# Altium schematic sheet Connectors_and_Regs.SchDoc
size A4; SheetNumber: 1; SheetTotal: 5
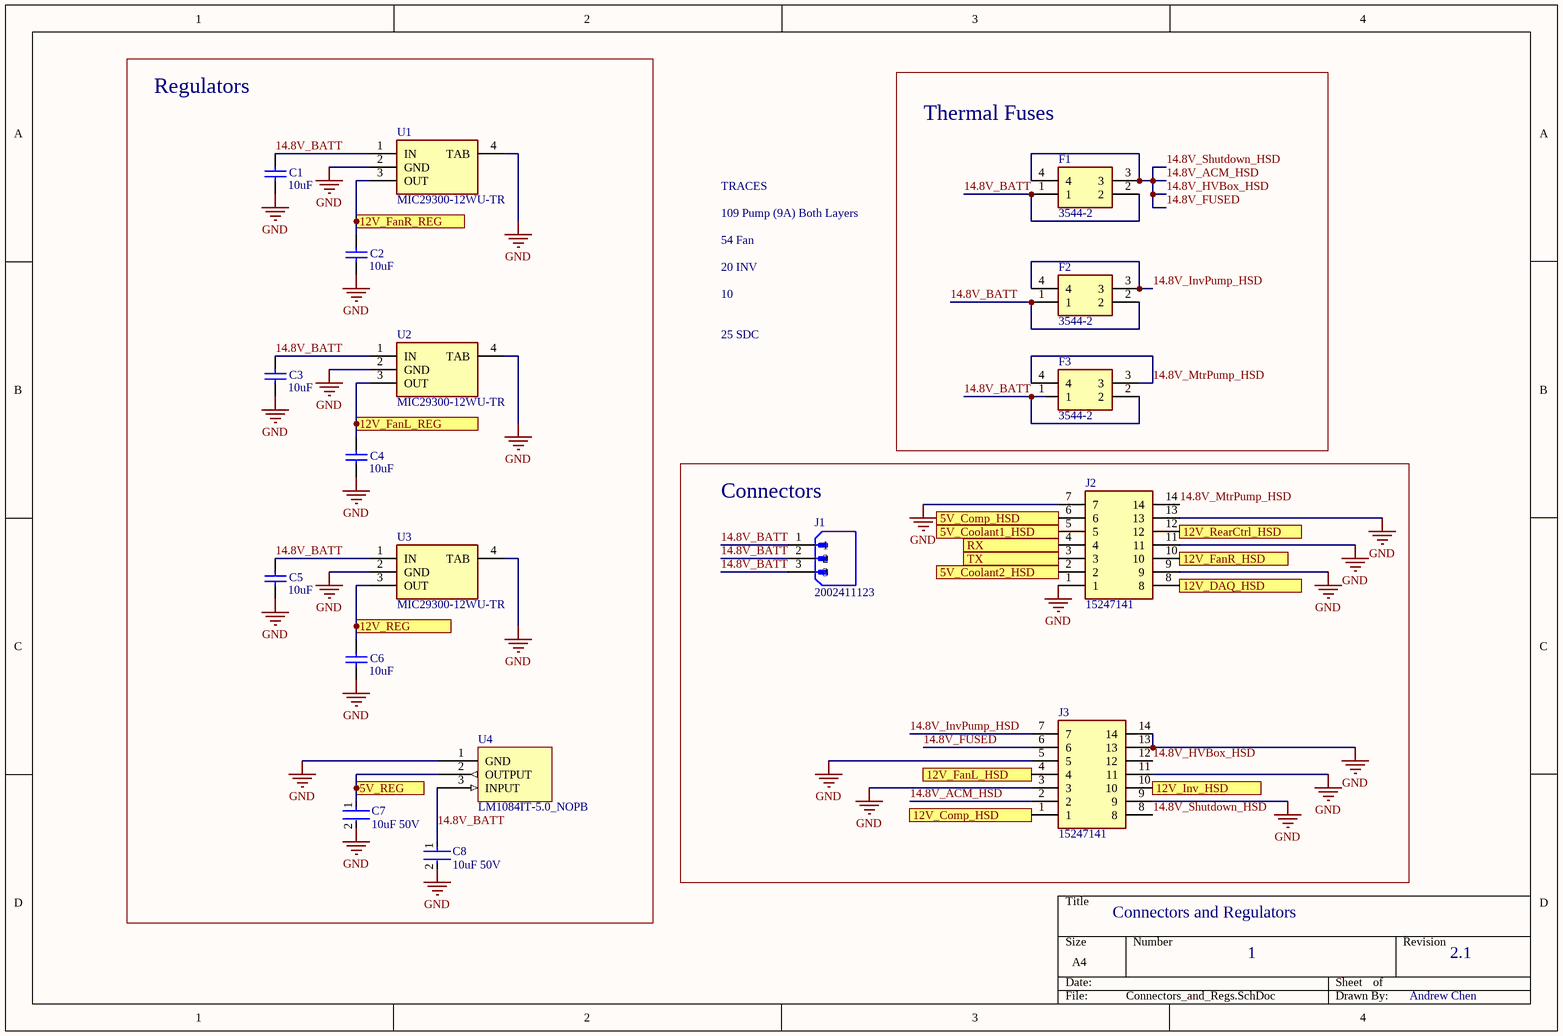
[diagram p0: Connectors_and_Regs.SchDoc]

## Parts
C1  10uF  [C1206]
C2  10uF  [C1206]
C3  10uF  [C1206]
C4  10uF  [C1206]
C5  10uF  [C1206]
C6  10uF  [C1206]
C7  10uF 50V  [FP-CL31-IPC_A]
C8  10uF 50V  [FP-CL31-IPC_A]
F1  3544-2  [3544-2]
F2  3544-2  [3544-2]
F3  3544-2  [3544-2]
J1  2002411123  [2002411YY3_11/12/13]
J2  15247141  [MOLEX_15247141]
J3  15247141  [MOLEX_15247141]
U1  MIC29300-12WU-TR  [MIC2930012WUTR]
U2  MIC29300-12WU-TR  [MIC2930012WUTR]
U3  MIC29300-12WU-TR  [MIC2930012WUTR]
U4  LM1084IT-5.0_NOPB  [TO254P470X1028X1955-3P]

## Blocks framed on the sheet
Regulators: C1-C8 U1-U4
Thermal Fuses: F1-F3
Connectors: J1-J3

## Ports
5V_Comp_HSD, 5V_Coolant1_HSD, 5V_Coolant2_HSD, 5V_REG, 12V_Comp_HSD, 12V_DAQ_HSD, 12V_FanL_HSD, 12V_FanL_REG, 12V_FanR_HSD, 12V_FanR_REG, 12V_Inv_HSD, 12V_RearCtrl_HSD, 12V_REG, RX, TX

## Nets
GND: C1.2 C2.2 C3.2 C4.2 C5.2 C6.2 C7.2 C8.2 J2.1 J2.7 J2.9 J2.11 J2.13 J3.3 J3.5 J3.9 J3.11 J3.13 J3.14 U1.2(GND) U1.4(TAB) U2.2(GND) U2.4(TAB) U3.2(GND) U3.4(TAB) U4.1
5V_Comp_HSD: J2.6 ; port 5V_Comp_HSD
5V_Coolant1_HSD: J2.5 ; port 5V_Coolant1_HSD
5V_Coolant2_HSD: J2.2 ; port 5V_Coolant2_HSD
5V_REG: C7.1 U4.2 ; port 5V_REG
12V_Comp_HSD: J3.1 ; port 12V_Comp_HSD
12V_DAQ_HSD: J2.8 ; port 12V_DAQ_HSD
12V_FanL_HSD: J3.4 ; port 12V_FanL_HSD
12V_FanL_REG: C4.1 U2.3(OUT) ; port 12V_FanL_REG
12V_FanR_HSD: J2.10 ; port 12V_FanR_HSD
12V_FanR_REG: C2.1 U1.3(OUT) ; port 12V_FanR_REG
12V_Inv_HSD: J3.10 ; port 12V_Inv_HSD
12V_RearCtrl_HSD: J2.12 ; port 12V_RearCtrl_HSD
12V_REG: C6.1 U3.3(OUT) ; port 12V_REG
14.8V_ACM_HSD: F1.3 F1.4 J3.2 J3.6 J3.8 J3.12  [also labelled 14.8V_FUSED, 14.8V_HVBox_HSD, 14.8V_Shutdown_HSD]
14.8V_BATT: C1.1 C3.1 C5.1 C8.1 F1.1 F1.2 F2.1 F2.2 F3.1 F3.2 J1.1 J1.2 J1.3 U1.1(IN) U2.1(IN) U3.1(IN) U4.3
14.8V_InvPump_HSD: F2.3 F2.4 J3.7
14.8V_MtrPump_HSD: F3.3 F3.4 J2.14
RX: J2.4 ; port RX
TX: J2.3 ; port TX

## Notes on the sheet
- 109 Pump (9A) Both Layers
- 54 Fan
- TRACES
- 20 INV
- 10
- 25 SDC
- Connectors and Regulators
- 1
- 2.1
- Andrew Chen
- (in symbol LM1084IT-5.0_NOPB) GND; OUTPUT; INPUT

## Library data of the parts
C1-C6 = Cap Semi: Capacitor (Semiconductor SIM Model); Value: 100nF; Published: 8-Jun-2000; LatestRevisionDate: 29-May-2009; LatestRevisionNote: IPC-7351 Footprint Added.; PackageReference: C1206; Publisher: Altium Limited; PackageDescription: Chip Capacitor
C7 C8 = CMP-13271-002699-1: Cap Ceramic 4.7uF 16V X7R ±10% SMD 1206 +125°C Embossed T/R; Length: 0.126inch; Radiation Hardening: No; Depth: 1.6mm; Min Operating Temperature: -55°C; Mount: Surface Mount; Width: 0.063inch; Thickness: 0.071inch; Case Code (Metric): 3216; Height: 1.6mm; Capacitance: 4.7uF; Package Quantity: 1; Voltage Rating: 16V; Tolerance: 10%; Dielectric: X7R; Packaging: Tape and Reel; Case/Package: 1206; Case Code (Imperial): 1206; Max Operating Temperature: 125°C
F1-F3 = 3549-2: Fuse; Manufacturer_Name: Keystone Electronics; Datasheet Link: https://componentsearchengine.com/Datasheets/1/3549-2.pdf; Height: 5.66mm; Manufacturer_Part_Number: 3549-2; Mouser Part Number: 534-3549-2; Mouser Price/Stock: https://www.mouser.co.uk/ProductDetail/Keystone-Electronics/3549-2?qs=fP5bVVCrK%2Fei3gwwxH1JKw%3D%3D
J2 J3 = 15246142: Connector; Manufacturer_Name: Molex; Datasheet Link: https://www.molex.com/pdm_docs/sd/015246041_sd.pdf; Height: 13.6mm; Manufacturer_Part_Number: 15246142
U1-U3 = MIC29300-12WU-TR: Integrated Circuit; Manufacturer_Name: Microchip; Datasheet Link: http://www.microchip.com/mymicrochip/filehandler.aspx?ddocname=en580805; Height: 4.597mm; Manufacturer_Part_Number: MIC29300-12WU-TR; Mouser Part Number: 998-MIC29300-12WUTR; Mouser Price/Stock: https://www.mouser.co.uk/ProductDetail/Microchip-Technology-Micrel/MIC29300-12WU-TR?qs=U6T8BxXiZAUm3rpKH4l03A%3D%3D; Arrow Part Number: MIC29300-12WU-TR; Arrow Price/Stock: https://www.arrow.com/en/products/mic29300-12wu-tr/microchip-technology?region=nac
J1 = 2002411123: Availability: Unavailable; MP: 2002411123; Package: None; Value: *; Price: None